# Altium schematic sheet Top Level.SchDoc: Top Level
size A4; DocumentNumber: 1; Revision: 2; SheetNumber: 1; SheetTotal: 6
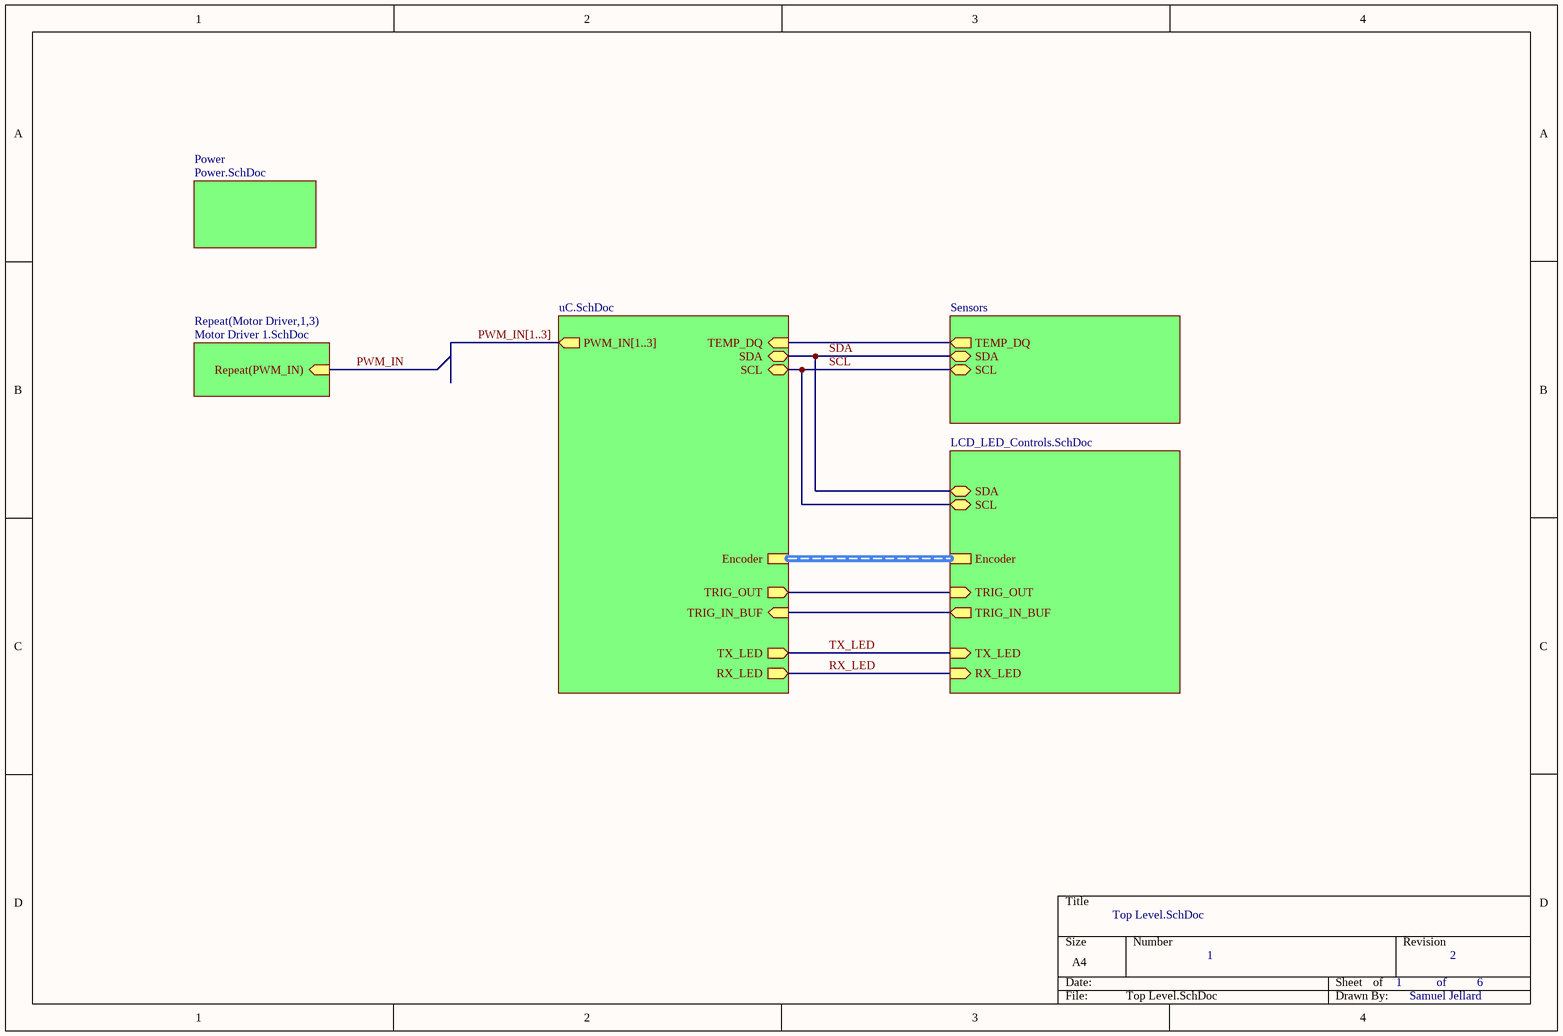
[diagram p0: Top Level.SchDoc]

## Sub-sheets
Designator = LCD_LED_Controls.SchDoc: SDA (bidir), SCL (bidir), TX_LED (in), RX_LED (in), Encoder (harness *), TRIG_OUT (in), TRIG_IN_BUF (out)
Power = Power.SchDoc: no entries
Repeat(Motor Driver,1,3) = Motor Driver 1.SchDoc: Repeat(PWM_IN) (in)
Sensors = Sensors.SchDoc: SDA (bidir), SCL (bidir), TEMP_DQ (out)
uC = uC.SchDoc: SDA (bidir), SCL (bidir), RX_LED (out), TX_LED (out), PWM_IN[1..3] (out), TEMP_DQ (in), Encoder (harness *), TRIG_OUT (out), TRIG_IN_BUF (in)

## Nets
PWM_IN: sheet Repeat(Motor Driver,1,3)/Repeat(PWM_IN)
RX_LED: sheet uC/RX_LED, sheet Designator/RX_LED
SCL: sheet uC/SCL, sheet Sensors/SCL, sheet Designator/SCL
SDA: sheet uC/SDA, sheet Sensors/SDA, sheet Designator/SDA
TX_LED: sheet uC/TX_LED, sheet Designator/TX_LED
(unnamed): sheet uC/TEMP_DQ, sheet Sensors/TEMP_DQ
(unnamed): sheet uC/TRIG_OUT, sheet Designator/TRIG_OUT
(unnamed): sheet uC/TRIG_IN_BUF, sheet Designator/TRIG_IN_BUF

## Buses and harness runs
bus PWM_IN[1..3] = sheet uC/PWM_IN[1..3]
harness sheet Designator/Encoder = sheet uC/Encoder

## Notes on the sheet
- of
- Samuel Jellard